# EAGLE design TeensyAmp_R4.0 (EAGLE 9.6.2)

## Sheet 1 of 3
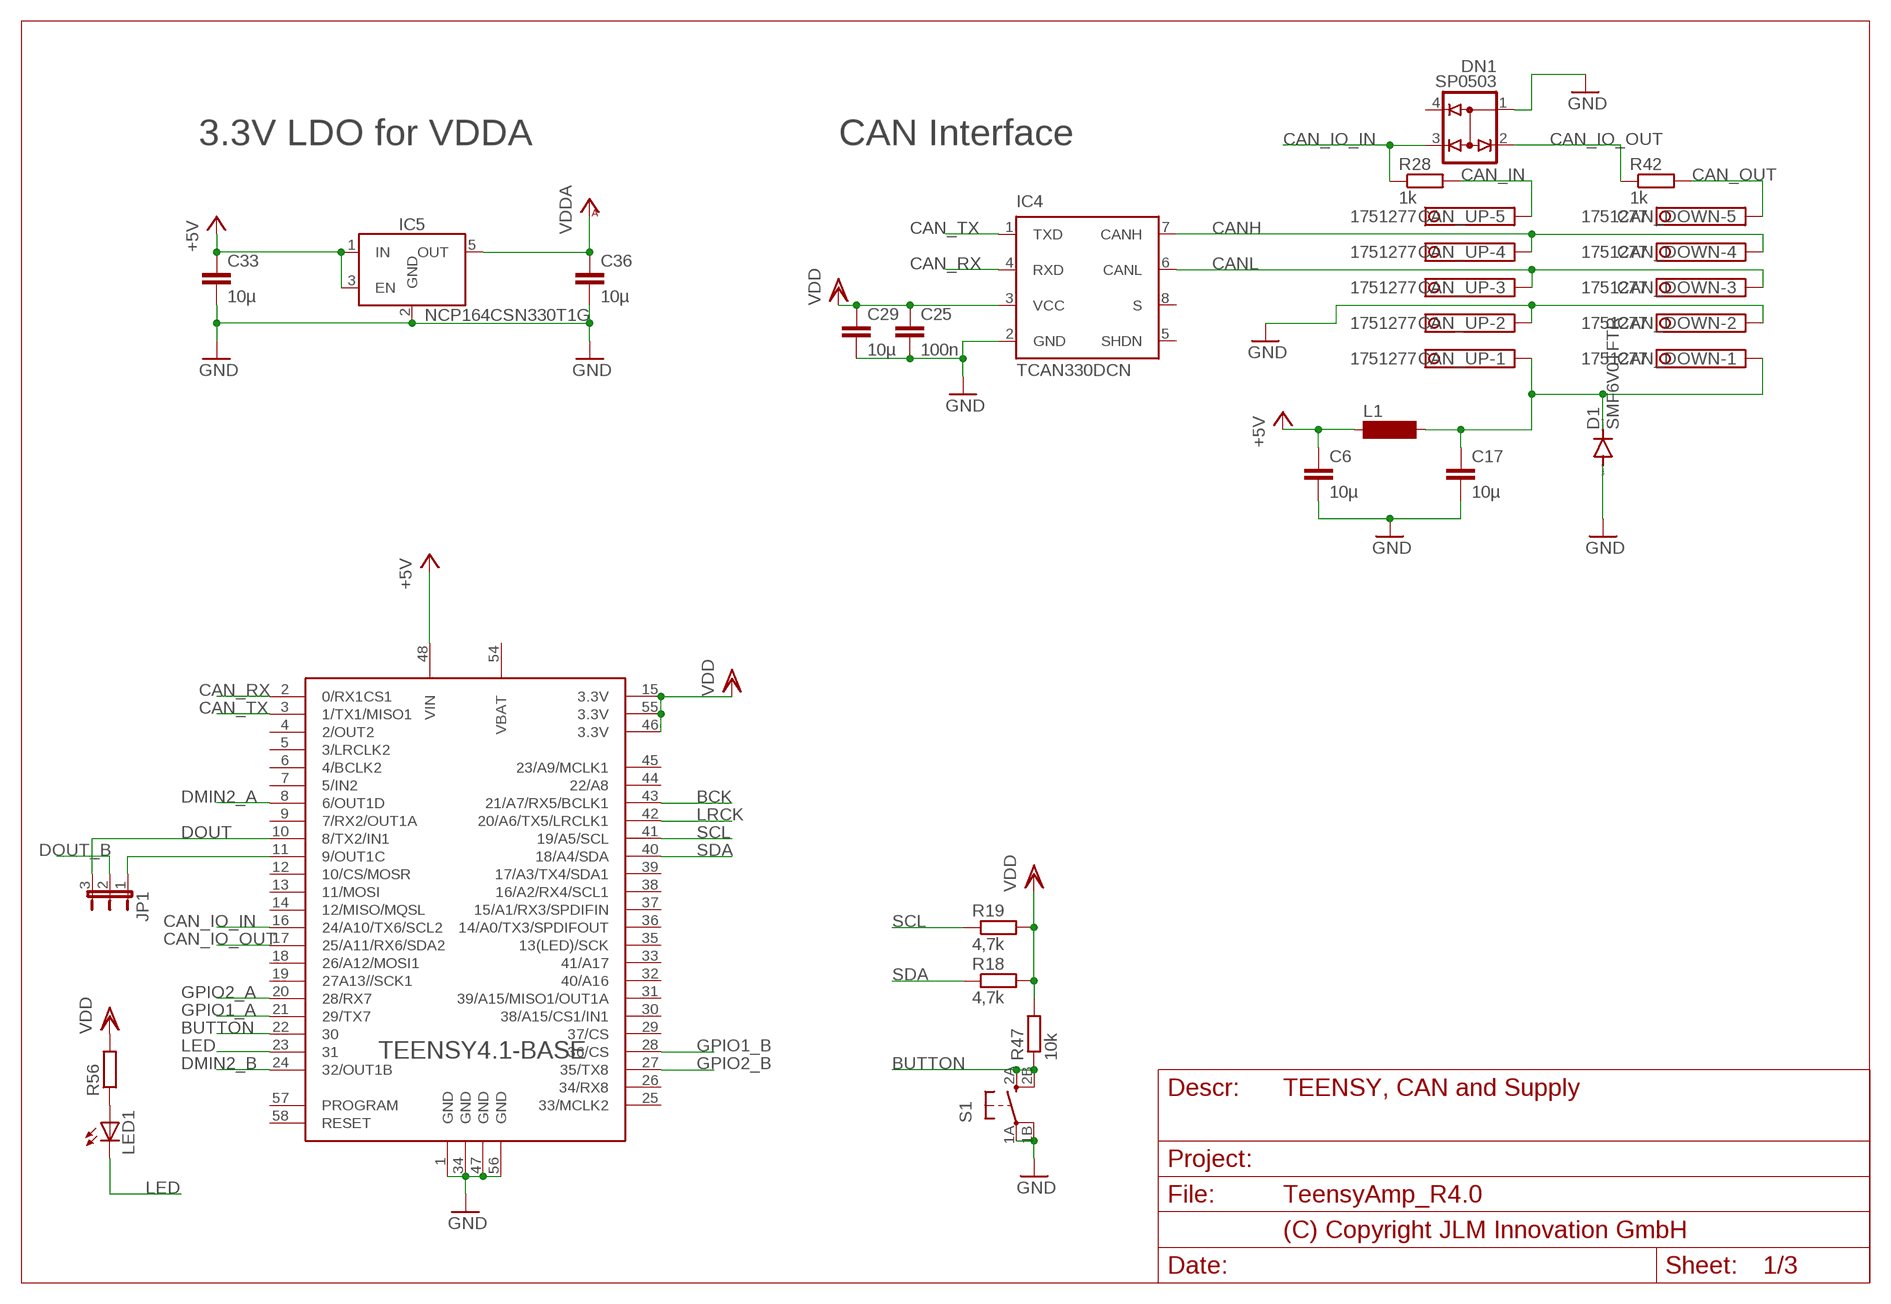
[diagram p0: schematic, sheet 1]
FRAME2 (DINA4_L): PAGE_DESCRIPTION: TEENSY, CAN and Supply

### Parts
C6  10µ  C-EUC0805  [C0805]
C17  10µ  C-EUC0805  [C0805]
C25  100n  C-EU0402-NARROW  [0402-N]
C29  10µ  C-EUC0603  [C0603]
C33  10µ  C-EUC0603  [C0603]
C36  10µ  C-EUC0603  [C0603]
CAN_DOWN  1751277  [1751277]
CAN_UP  1751277  [1751277]
D1  SMF6V0TFTR  DIODE-SOD123  [SOD123]
DN1  SP0503  [SOT143-R]
IC4  TCAN330DCN  [SOT65P280X145-8N]
IC5  NCP164CSN330T1G  LDO_ENSOT23-5  [SOT23-5]
JP1  JP2E  [JP2]
L1  L_JLM0805  [R0805]
LED1  LEDCHIP-LED0603  [CHIP-LED0603]
R18  4,7k  R_JLMR0402  [R0402]
R19  4,7k  R_JLMR0402  [R0402]
R28  1k  R_JLM0402-NARROW  [0402-N]
R42  1k  R_JLM0402-NARROW  [0402-N]
R47  10k  R_JLMR0402  [R0402]
R56  R_JLMR0402  [R0402]
S1  SWITCH7914  [7914J]
TEENSY4.1  TEENSY4.1  [TEENSY4.1]

### Nets
+5V: C6.1 C33.1 IC5.1(IN) IC5.3(EN) L1.1 TEENSY4.1.48(-BASE:VIN)
BCK: TEENSY4.1.43(-BASE:21/A7/RX5/BCLK1) ; also sheet 2,3
BUTTON: R47.1 S1.2A(S) S1.2B(S1) TEENSY4.1.22
CAN_IN: CAN_UP.5 R28.2
CAN_IO_IN: DN1.3(C3) R28.1 TEENSY4.1.16(-BASE:24/A10/TX6/SCL2)
CAN_IO_OUT: DN1.2(C2) R42.1 TEENSY4.1.17(-BASE:25/A11/RX6/SDA2)
CAN_OUT: CAN_DOWN.5 R42.2
CAN_RX: IC4.4(RXD) TEENSY4.1.2(-BASE:0/RX1CS1)
CAN_TX: IC4.1(TXD) TEENSY4.1.3(-BASE:1/TX1/MISO1)
CANH: CAN_DOWN.4 CAN_UP.4 IC4.7(CANH)
CANL: CAN_DOWN.3 CAN_UP.3 IC4.6(CANL)
DMIN2_A: TEENSY4.1.8(-BASE:6/OUT1D) ; also sheet 2
DMIN2_B: TEENSY4.1.24(-BASE:32/OUT1B) ; also sheet 3
DOUT: JP1.3 TEENSY4.1.10(-BASE:8/TX2/IN1) ; also sheet 2
DOUT_B: JP1.2 ; also sheet 3
GND: C6.2 C17.2 C25.2 C29.2 C33.2 C36.2 CAN_DOWN.2 CAN_UP.2 D1.A DN1.1(A1) IC4.2(GND) IC5.2(GND) S1.1A(P) S1.1B(P1) TEENSY4.1.1(-BASE:GND) TEENSY4.1.34(-BASE:GND) TEENSY4.1.47(-BASE:GND) TEENSY4.1.56(-BASE:GND) ; also sheet 2,3
GPIO1_A: TEENSY4.1.21(-BASE:29/TX7) ; also sheet 2
GPIO1_B: TEENSY4.1.28(-BASE:36/CS) ; also sheet 3
GPIO2_A: TEENSY4.1.20(-BASE:28/RX7) ; also sheet 2
GPIO2_B: TEENSY4.1.27(-BASE:35/TX8) ; also sheet 3
LED: LED1.C TEENSY4.1.23
LRCK: TEENSY4.1.42(-BASE:20/A6/TX5/LRCLK1) ; also sheet 2,3
N$12: C17.1 CAN_DOWN.1 CAN_UP.1 D1.C L1.2
N$71: LED1.A R56.1
N$80: JP1.1 TEENSY4.1.11(-BASE:9/OUT1C)
SCL: R19.1 TEENSY4.1.41(-BASE:19/A5/SCL) ; also sheet 2,3
SDA: R18.1 TEENSY4.1.40(-BASE:18/A4/SDA) ; also sheet 2,3
VDD: C25.1 C29.1 IC4.3(VCC) R18.2 R19.2 R47.2 R56.2 TEENSY4.1.15(-BASE:3.3V) TEENSY4.1.46(-BASE:3.3V) TEENSY4.1.55(-BASE:3.3V) ; also sheet 2,3
VDDA: C36.1 IC5.5(OUT) ; also sheet 2,3
Unconnected: DN1.4(C4) IC4.5(SHDN) IC4.8(S) TEENSY4.1.4(-BASE:2/OUT2) TEENSY4.1.5(-BASE:3/LRCLK2) TEENSY4.1.6(-BASE:4/BCLK2) TEENSY4.1.7(-BASE:5/IN2) TEENSY4.1.9(-BASE:7/RX2/OUT1A) TEENSY4.1.12(-BASE:10/CS/MOSR) TEENSY4.1.13(-BASE:11/MOSI) TEENSY4.1.14(-BASE:12/MISO/MQSL) TEENSY4.1.18(-BASE:26/A12/MOSI1) TEENSY4.1.19(-BASE:27A13//SCK1) TEENSY4.1.25(-BASE:33/MCLK2) TEENSY4.1.26(-BASE:34/RX8) TEENSY4.1.29(-BASE:37/CS) TEENSY4.1.30(-BASE:38/A15/CS1/IN1) TEENSY4.1.31(-BASE:39/A15/MISO1/OUT1A) TEENSY4.1.32(-BASE:40/A16) TEENSY4.1.33(-BASE:41/A17) TEENSY4.1.35(-BASE:13(LED)/SCK) TEENSY4.1.36(-BASE:14/A0/TX3/SPDIFOUT) TEENSY4.1.37(-BASE:15/A1/RX3/SPDIFIN) TEENSY4.1.38(-BASE:16/A2/RX4/SCL1) TEENSY4.1.39(-BASE:17/A3/TX4/SDA1) TEENSY4.1.44(-BASE:22/A8) TEENSY4.1.45(-BASE:23/A9/MCLK1) TEENSY4.1.49(-USB:U5V) TEENSY4.1.50(-USB:UDM) TEENSY4.1.51(-USB:UDP) TEENSY4.1.52(-USB:UGND1) TEENSY4.1.53(-USB:UGND2) TEENSY4.1.57(-BASE:PROGRAM) TEENSY4.1.58(-BASE:RESET) TEENSY4.1.59(-ETHERNET:ER-) TEENSY4.1.60(-ETHERNET:ER+) TEENSY4.1.61(-ETHERNET:EGND) TEENSY4.1.62(-ETHERNET:ELED) TEENSY4.1.63(-ETHERNET:ET-) TEENSY4.1.64(-ETHERNET:ET+)

### Notes on the sheet
- 3.3V LDO for VDDA | CAN Interface

## Sheet 2 of 3
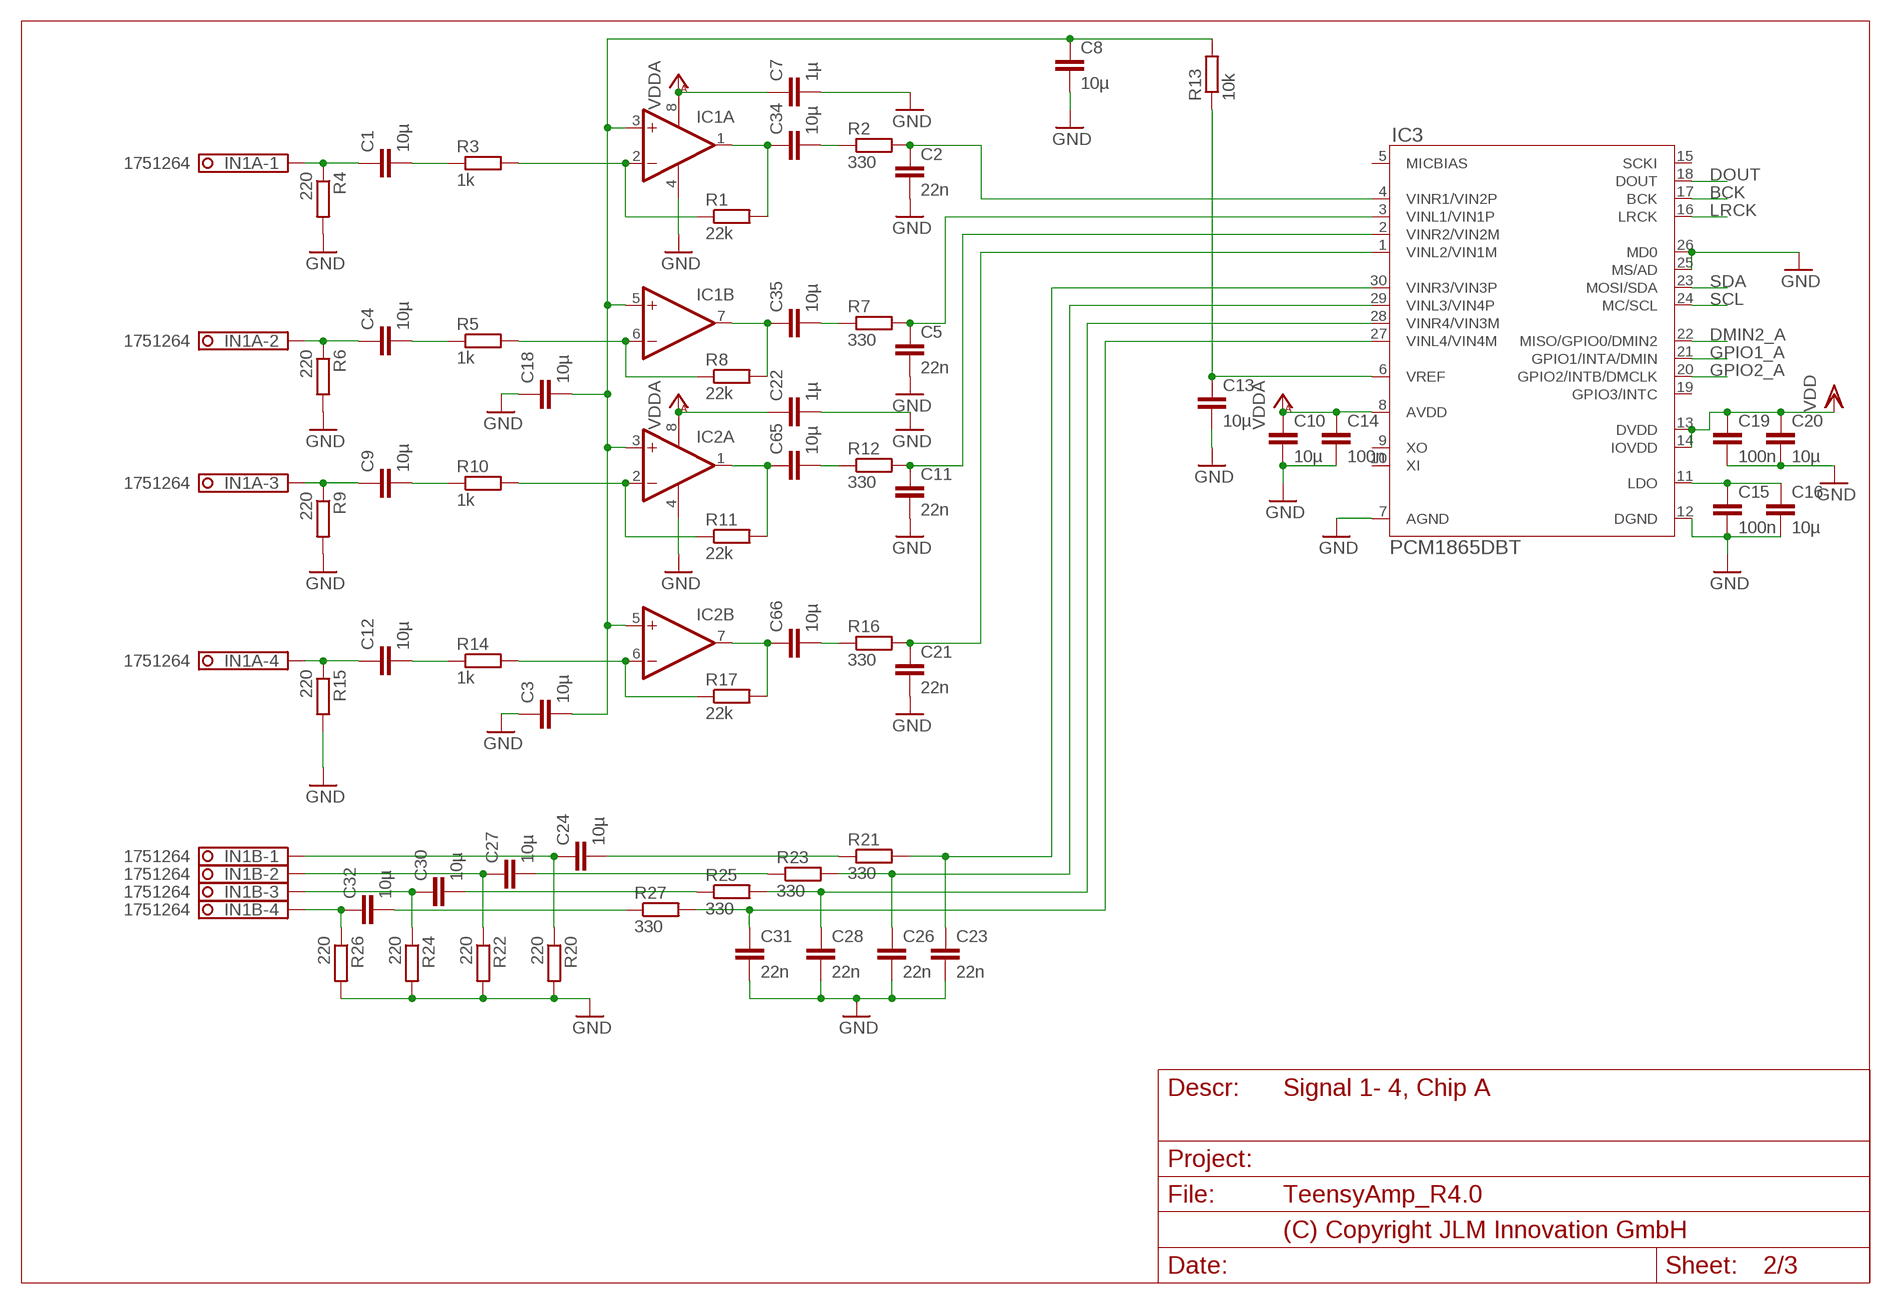
[diagram p1: schematic, sheet 2]
FRAME1 (DINA4_L): PAGE_DESCRIPTION: Signal 1- 4, Chip A

### Parts
C1  10µ  C-EUC0805  [C0805]
C2  22n  C-EUC0603  [C0603]
C3  10µ  C-EUC0603  [C0603]
C4  10µ  C-EUC0805  [C0805]
C5  22n  C-EUC0603  [C0603]
C7  1µ  C-EUC0603  [C0603]
C8  10µ  C-EUC0603  [C0603]
C9  10µ  C-EUC0805  [C0805]
C10  10µ  C-EUC0603  [C0603]
C11  22n  C-EUC0603  [C0603]
C12  10µ  C-EUC0805  [C0805]
C13  10µ  C-EUC0603  [C0603]
C14  100n  C-EU0402-NARROW  [0402-N]
C15  100n  C-EU0402-NARROW  [0402-N]
C16  10µ  C-EUC0603  [C0603]
C18  10µ  C-EUC0603  [C0603]
C19  100n  C-EU0402-NARROW  [0402-N]
C20  10µ  C-EUC0603  [C0603]
C21  22n  C-EUC0603  [C0603]
C22  1µ  C-EUC0603  [C0603]
C23  22n  C-EUC0603  [C0603]
C24  10µ  C-EUC0805  [C0805]
C26  22n  C-EUC0603  [C0603]
C27  10µ  C-EUC0805  [C0805]
C28  22n  C-EUC0603  [C0603]
C30  10µ  C-EUC0805  [C0805]
C31  22n  C-EUC0603  [C0603]
C32  10µ  C-EUC0805  [C0805]
C34  10µ  C-EUC0805  [C0805]
C35  10µ  C-EUC0805  [C0805]
C65  10µ  C-EUC0805  [C0805]
C66  10µ  C-EUC0805  [C0805]
IC1  OPA2344E  [MSOP08]
IC2  OPA2344E  [MSOP08]
IC3  PCM1865DBT  [SOP50P640X120-30N]
IN1A  1751264  [1751264]
IN1B  1751264  [1751264]
R1  22k  R_JLMR0603  [R0603]
R2  330  R_JLMR0603  [R0603]
R3  1k  R_JLMR0603  [R0603]
R4  220  R_JLMR0603  [R0603]
R5  1k  R_JLMR0603  [R0603]
R6  220  R_JLMR0603  [R0603]
R7  330  R_JLMR0603  [R0603]
R8  22k  R_JLMR0603  [R0603]
R9  220  R_JLMR0603  [R0603]
R10  1k  R_JLMR0603  [R0603]
R11  22k  R_JLMR0603  [R0603]
R12  330  R_JLMR0603  [R0603]
R13  10k  R_JLM0402-NARROW  [0402-N]
R14  1k  R_JLMR0603  [R0603]
R15  220  R_JLMR0603  [R0603]
R16  330  R_JLMR0603  [R0603]
R17  22k  R_JLMR0603  [R0603]
R20  220  R_JLMR0603  [R0603]
R21  330  R_JLMR0603  [R0603]
R22  220  R_JLMR0603  [R0603]
R23  330  R_JLMR0603  [R0603]
R24  220  R_JLMR0603  [R0603]
R25  330  R_JLMR0603  [R0603]
R26  220  R_JLMR0603  [R0603]
R27  330  R_JLMR0603  [R0603]

### Nets
BCK: IC3.17(BCK) ; also sheet 1,3
DMIN2_A: IC3.22(MISO/GPIO0/DMIN2) ; also sheet 1
DOUT: IC3.18(DOUT) ; also sheet 1
GND: C2.2 C3.1 C5.2 C7.2 C8.2 C10.2 C11.2 C13.2 C14.2 C15.2 C16.2 C18.1 C19.2 C20.2 C21.2 C22.2 C23.2 C26.2 C28.2 C31.2 IC1.4(A:V-) IC2.4(A:V-) IC3.7(AGND) IC3.12(DGND) IC3.25(MS/AD) IC3.26(MD0) R4.2 R6.2 R9.2 R15.2 R20.2 R22.2 R24.2 R26.2 ; also sheet 1,3
GPIO1_A: IC3.21(GPIO1/INTA/DMIN) ; also sheet 1
GPIO2_A: IC3.20(GPIO2/INTB/DMCLK) ; also sheet 1
LRCK: IC3.16(LRCK) ; also sheet 1,3
N$1: C31.1 IC3.27(VINL4/VIN4M) R27.2
N$2: C28.1 IC3.28(VINR4/VIN3M) R25.2
N$3: C26.1 IC3.29(VINL3/VIN4P) R23.2
N$4: C23.1 IC3.30(VINR3/VIN3P) R21.2
N$5: C21.1 IC3.1(VINL2/VIN1M) R16.2
N$6: C11.1 IC3.2(VINR2/VIN2M) R12.2
N$7: C5.1 IC3.3(VINL1/VIN1P) R7.2
N$8: C2.1 IC3.4(VINR1/VIN2P) R2.2
N$9: C32.2 R27.1
N$10: C24.1 IN1B.1 R20.1
N$11: C15.1 C16.1 IC3.11(LDO)
N$13: C27.1 IN1B.2 R22.1
N$14: C30.1 IN1B.3 R24.1
N$15: C32.1 IN1B.4 R26.1
N$16: C12.1 IN1A.4 R15.1
N$18: C9.1 IN1A.3 R9.1
N$19: C4.1 IN1A.2 R6.1
N$20: C30.2 R25.1
N$21: C1.1 IN1A.1 R4.1
N$22: C27.2 R23.1
N$23: C4.2 R5.1
N$24: C9.2 R10.1
N$25: C1.2 R3.1
N$26: C12.2 R14.1
N$28: C34.1 IC1.1(A:OUT) R1.2
N$29: C35.1 IC1.7(B:OUT) R8.2
N$30: C65.1 IC2.1(A:OUT) R11.2
N$31: IC1.2(A:-IN) R1.1 R3.2
N$32: IC1.6(B:-IN) R5.2 R8.1
N$33: IC2.2(A:-IN) R10.2 R11.1
N$34: IC2.6(B:-IN) R14.2 R17.1
N$35: C66.1 IC2.7(B:OUT) R17.2
N$36: C24.2 R21.1
N$37: C13.1 IC3.6(VREF) R13.1
N$73: C34.2 R2.1
N$74: C3.2 C8.1 C18.2 IC1.3(A:+IN) IC1.5(B:+IN) IC2.3(A:+IN) IC2.5(B:+IN) R13.2
N$75: C35.2 R7.1
N$76: C65.2 R12.1
N$77: C66.2 R16.1
SCL: IC3.24(MC/SCL) ; also sheet 1,3
SDA: IC3.23(MOSI/SDA) ; also sheet 1,3
VDD: C19.1 C20.1 IC3.13(DVDD) IC3.14(IOVDD) ; also sheet 1,3
VDDA: C7.1 C10.1 C14.1 C22.1 IC1.8(A:V+) IC2.8(A:V+) IC3.8(AVDD) ; also sheet 1,3
Unconnected: IC3.5(MICBIAS) IC3.9(XO) IC3.10(XI) IC3.15(SCKI) IC3.19(GPIO3/INTC)

## Sheet 3 of 3
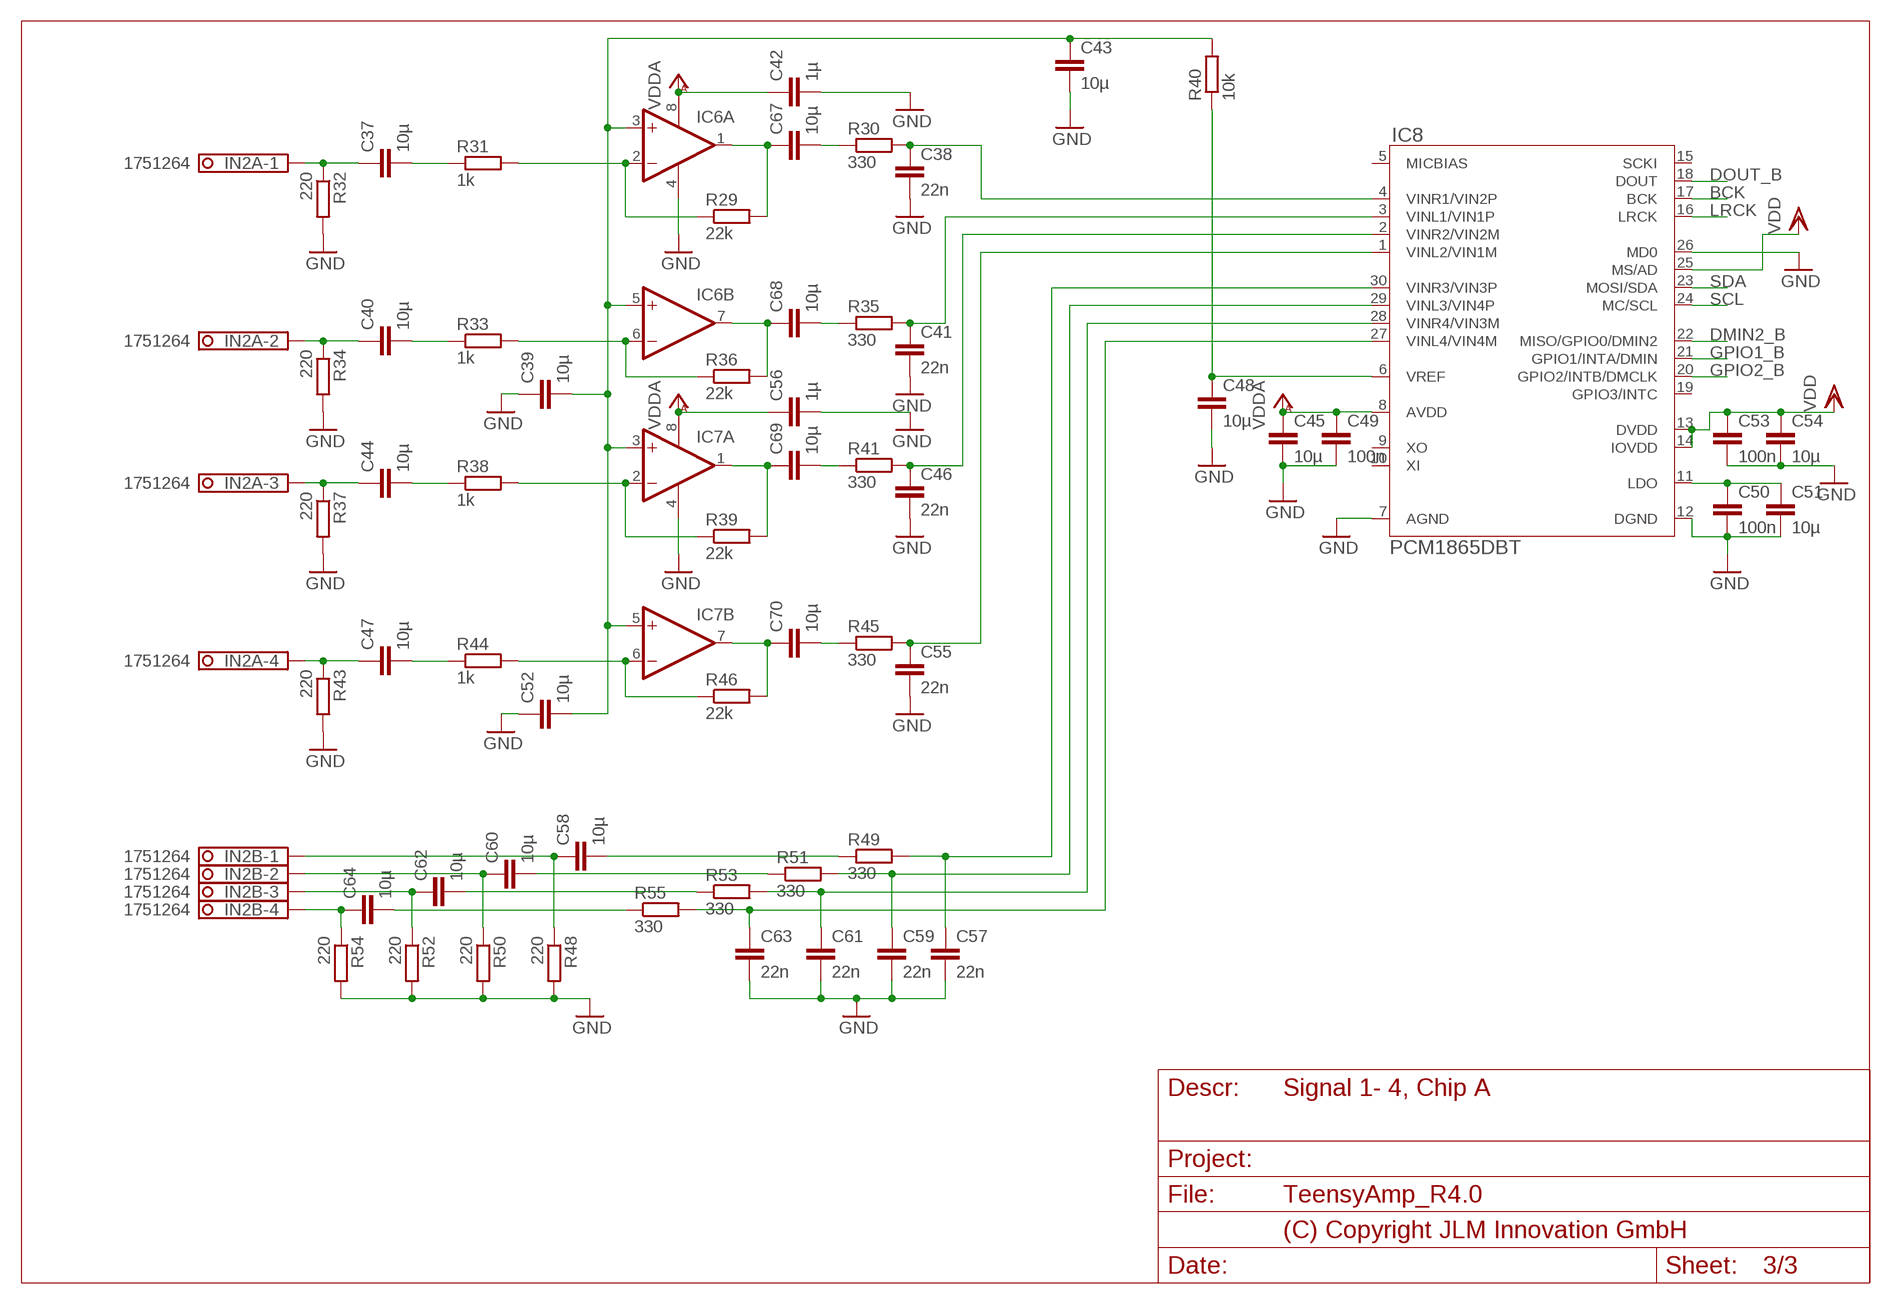
[diagram p2: schematic, sheet 3]
FRAME3 (DINA4_L): PAGE_DESCRIPTION: Signal 1- 4, Chip A

### Parts
C37  10µ  C-EUC0805  [C0805]
C38  22n  C-EUC0603  [C0603]
C39  10µ  C-EUC0603  [C0603]
C40  10µ  C-EUC0805  [C0805]
C41  22n  C-EUC0603  [C0603]
C42  1µ  C-EUC0603  [C0603]
C43  10µ  C-EUC0603  [C0603]
C44  10µ  C-EUC0805  [C0805]
C45  10µ  C-EUC0603  [C0603]
C46  22n  C-EUC0603  [C0603]
C47  10µ  C-EUC0805  [C0805]
C48  10µ  C-EUC0603  [C0603]
C49  100n  C-EU0402-NARROW  [0402-N]
C50  100n  C-EU0402-NARROW  [0402-N]
C51  10µ  C-EUC0603  [C0603]
C52  10µ  C-EUC0603  [C0603]
C53  100n  C-EU0402-NARROW  [0402-N]
C54  10µ  C-EUC0603  [C0603]
C55  22n  C-EUC0603  [C0603]
C56  1µ  C-EUC0603  [C0603]
C57  22n  C-EUC0603  [C0603]
C58  10µ  C-EUC0805  [C0805]
C59  22n  C-EUC0603  [C0603]
C60  10µ  C-EUC0805  [C0805]
C61  22n  C-EUC0603  [C0603]
C62  10µ  C-EUC0805  [C0805]
C63  22n  C-EUC0603  [C0603]
C64  10µ  C-EUC0805  [C0805]
C67  10µ  C-EUC0805  [C0805]
C68  10µ  C-EUC0805  [C0805]
C69  10µ  C-EUC0805  [C0805]
C70  10µ  C-EUC0805  [C0805]
IC6  OPA2344E  [MSOP08]
IC7  OPA2344E  [MSOP08]
IC8  PCM1865DBT  [SOP50P640X120-30N]
IN2A  1751264  [1751264]
IN2B  1751264  [1751264]
R29  22k  R_JLMR0603  [R0603]
R30  330  R_JLMR0603  [R0603]
R31  1k  R_JLMR0603  [R0603]
R32  220  R_JLMR0603  [R0603]
R33  1k  R_JLMR0603  [R0603]
R34  220  R_JLMR0603  [R0603]
R35  330  R_JLMR0603  [R0603]
R36  22k  R_JLMR0603  [R0603]
R37  220  R_JLMR0603  [R0603]
R38  1k  R_JLMR0603  [R0603]
R39  22k  R_JLMR0603  [R0603]
R40  10k  R_JLM0402-NARROW  [0402-N]
R41  330  R_JLMR0603  [R0603]
R43  220  R_JLMR0603  [R0603]
R44  1k  R_JLMR0603  [R0603]
R45  330  R_JLMR0603  [R0603]
R46  22k  R_JLMR0603  [R0603]
R48  220  R_JLMR0603  [R0603]
R49  330  R_JLMR0603  [R0603]
R50  220  R_JLMR0603  [R0603]
R51  330  R_JLMR0603  [R0603]
R52  220  R_JLMR0603  [R0603]
R53  330  R_JLMR0603  [R0603]
R54  220  R_JLMR0603  [R0603]
R55  330  R_JLMR0603  [R0603]

### Nets
BCK: IC8.17(BCK) ; also sheet 1,2
DMIN2_B: IC8.22(MISO/GPIO0/DMIN2) ; also sheet 1
DOUT_B: IC8.18(DOUT) ; also sheet 1
GND: C38.2 C39.1 C41.2 C42.2 C43.2 C45.2 C46.2 C48.2 C49.2 C50.2 C51.2 C52.1 C53.2 C54.2 C55.2 C56.2 C57.2 C59.2 C61.2 C63.2 IC6.4(A:V-) IC7.4(A:V-) IC8.7(AGND) IC8.12(DGND) IC8.26(MD0) R32.2 R34.2 R37.2 R43.2 R48.2 R50.2 R52.2 R54.2 ; also sheet 1,2
GPIO1_B: IC8.21(GPIO1/INTA/DMIN) ; also sheet 1
GPIO2_B: IC8.20(GPIO2/INTB/DMCLK) ; also sheet 1
LRCK: IC8.16(LRCK) ; also sheet 1,2
N$17: C63.1 IC8.27(VINL4/VIN4M) R55.2
N$27: C61.1 IC8.28(VINR4/VIN3M) R53.2
N$38: C59.1 IC8.29(VINL3/VIN4P) R51.2
N$39: C57.1 IC8.30(VINR3/VIN3P) R49.2
N$40: C55.1 IC8.1(VINL2/VIN1M) R45.2
N$41: C46.1 IC8.2(VINR2/VIN2M) R41.2
N$42: C41.1 IC8.3(VINL1/VIN1P) R35.2
N$43: C50.1 C51.1 IC8.11(LDO)
N$44: C58.1 IN2B.1 R48.1
N$45: C60.1 IN2B.2 R50.1
N$46: C62.1 IN2B.3 R52.1
N$47: C64.1 IN2B.4 R54.1
N$48: IC6.2(A:-IN) R29.1 R31.2
N$49: IC6.6(B:-IN) R33.2 R36.1
N$50: IC7.2(A:-IN) R38.2 R39.1
N$51: IC7.6(B:-IN) R44.2 R46.1
N$52: C40.2 R33.1
N$53: C44.2 R38.1
N$54: C47.2 R44.1
N$55: C37.2 R31.1
N$56: C47.1 IN2A.4 R43.1
N$57: C44.1 IN2A.3 R37.1
N$58: C40.1 IN2A.2 R34.1
N$59: C37.1 IN2A.1 R32.1
N$60: C38.1 IC8.4(VINR1/VIN2P) R30.2
N$61: C62.2 R53.1
N$62: C60.2 R51.1
N$63: C58.2 R49.1
N$64: C64.2 R55.1
N$65: C48.1 IC8.6(VREF) R40.1
N$66: C69.1 IC7.1(A:OUT) R39.2
N$67: C68.1 IC6.7(B:OUT) R36.2
N$68: C67.1 IC6.1(A:OUT) R29.2
N$69: C70.1 IC7.7(B:OUT) R46.2
N$70: C39.2 C43.1 C52.2 IC6.3(A:+IN) IC6.5(B:+IN) IC7.3(A:+IN) IC7.5(B:+IN) R40.2
N$78: C70.2 R45.1
N$79: C69.2 R41.1
N$81: C68.2 R35.1
N$82: C67.2 R30.1
SCL: IC8.24(MC/SCL) ; also sheet 1,2
SDA: IC8.23(MOSI/SDA) ; also sheet 1,2
VDD: C53.1 C54.1 IC8.13(DVDD) IC8.14(IOVDD) IC8.25(MS/AD) ; also sheet 1,2
VDDA: C42.1 C45.1 C49.1 C56.1 IC6.8(A:V+) IC7.8(A:V+) IC8.8(AVDD) ; also sheet 1,2
Unconnected: IC8.5(MICBIAS) IC8.9(XO) IC8.10(XI) IC8.15(SCKI) IC8.19(GPIO3/INTC)

## Power pins joined to a net without a drawn wire
VBAT: TEENSY4.1.54(-BASE:VBAT)

## Library data of the parts
C1-C70 = jlm_cap:C-EU: CAPACITOR, European symbol
CAN_DOWN CAN_UP = jlm_con:1751277: MKDS 1/ 5-3,5 Printklemme Nennstrom: 10 A Bemessungsspannung: 160 V Raster: 3,5 mm Polzahl: 5 Montageart: Löten Anschlussart: Schraubanschluss Anschlussrichtung vom Leiter zur Platine: 0° Source: http://eshop.phoenixcontact.com .. 1751277.pdf; OC_FARNELL: unknown; OC_NEWARK: unknown
D1 = jlm_diode:DIODE-: DIODE; OC_FARNELL: 2989529
DN1 = jlm:SP0503: SP0503BA 3 5VDC ESD supression diodes (e.g. USB protection); OC_DIGIKEY: F2715CT-ND; OC_FARNELL: 1827633
IC1 IC2 IC6 IC7 = jlm_linear:OPA2*: Dual Operational Amplifier Low Power, Single-Supply, Rail-To-Rail Operational Amplifier Source: http://focus.ti.com/lit/ds/symlink/opa2345.pdf http://focus.ti.com .. opa241.pdf http://focus.ti.com/lit/ds/symlink/opa2134.pdf
IC3 IC8 = jlm_adc_dac:PCM1865: PCM1865 4-Channel, 192-kHz, Audio ADCs; OC_MOUSER: 595-PCM1865DBT
IC4 = jlm_digital:TCAN330
IC5 = jlm_power:LDO_EN; OC_FARNELL: 3367831
IN1A IN1B IN2A IN2B = jlm_con:1751264: MKDS 1/ 4-3,5 Printklemme Nennstrom: 10 A Bemessungsspannung: 160 V Raster: 3,5 mm Polzahl: 4 Montageart: Löten Anschlussart: Schraubanschluss Anschlussrichtung vom Leiter zur Platine: 0° Source: http://eshop.phoenixcontact.com .. 1751264.pdf; MPN: 1751264; OC_FARNELL: unknown; OC_NEWARK: 10R0934
JP1 = jumper:JP2E: JUMPER
L1 = jlm_inductor:L_JLM
LED1 = jlm_optical:LED: LED OSRAM: - CHIPLED LG R971, LG N971, LY N971, LG Q971, LY Q971, LO R971, LY R971 LH N974, LH R974 LS Q976, LO Q976, LY Q976 LO Q996 - Hyper CHIPLED LW Q18S LB Q993, LB Q99A, LB R99A - SideLED LS A670, LO A670, LY A670, LG A670, LP A670 LB A673, LV A673, LT A673, LW A673 LH A674 LY A675 LS A676, LA A676, LO A676, LY A676, LW A676 LS A679, LY A679, LG A679 - Hyper Micro SIDELED® LS Y876, LA Y876, LO Y876, LY Y876 LT Y87S - SmartLED LW L88C, LW L88S LB L89C, LB L89S, LG L890 LS L89K, LO L89K, LY L89K LS L896, LA L896, LO L896, LY L896 - TOPLED LS T670, LO T670, LY T670, LG T670, LP T670 LSG T670, LSP T670, LSY T670, LOP T670, LYG T670 LG T671, LOG T671, LSG T671 LB T673, LV T673, LT T673, LW T673 LH T674 LS T676, LA T676, LO T676, LY T676, LB T676, LH T676, LSB T676, LW T676 LB T67C, LV T67C, LT T67C, LS T67K, LO T67K, LY T67K, LW E67C LS E67B, LA E67B, LO E67B, LY E67B, LB E67C, LV E67C, LT E67C LW T67C LS T679, LY T679, LG T679 LS T770, LO T770, LY T770, LG T770, LP T770 LB T773, LV T773, LT T773, LW T773 LH T774 LS E675, LA E675, LY E675, LS T675 LS T776, LA T776, LO T776, LY T776, LB T776 LHGB T686 LT T68C, LB T68C - Hyper Mini TOPLED® LB M676 - Mini TOPLED Santana® LG M470 LS M47K, LO M47K, LY M47K Source: http://www.osram.convergy.de LUXEON: - LUMILED® LXK2-PW12-R00, LXK2-PW12-S00, LXK2-PW14-U00, LXK2-PW14-V00 LXK2-PM12-R00, LXK2-PM12-S00, LXK2-PM14-U00 LXK2-PE12-Q00, LXK2-PE12-R00, LXK2-PE12-S00, LXK2-PE14-T00, LXK2-PE14-U00 LXK2-PB12-K00, LXK2-PB12-L00, LXK2-PB12-M00, LXK2-PB14-N00, LXK2-PB14-P00, LXK2-PB14-Q00 LXK2-PR12-L00, LXK2-PR12-M00, LXK2-PR14-Q00, LXK2-PR14-R00 LXK2-PD12-Q00, LXK2-PD12-R00, LXK2-PD12-S00 LXK2-PH12-R00, LXK2-PH12-S00 LXK2-PL12-P00, LXK2-PL12-Q00, LXK2-PL12-R00 Source: www.luxeon.com KINGBRIGHT: KA-3528ASYC Source: www.kingbright.com
R1-R56 = jlm_resistors:R_JLM: RESISTOR, European symbol
S1 = jlm_switch:SWITCH7914: OMRON SWITCH; OC_FARNELL: 1607974
TEENSY4.1 = jlm_micro:TEENSY4.1: Teensy 4.1 Modul ease pin connections (top side ONLY) Separate "gates" for Ethernet and hosted USB

## Board
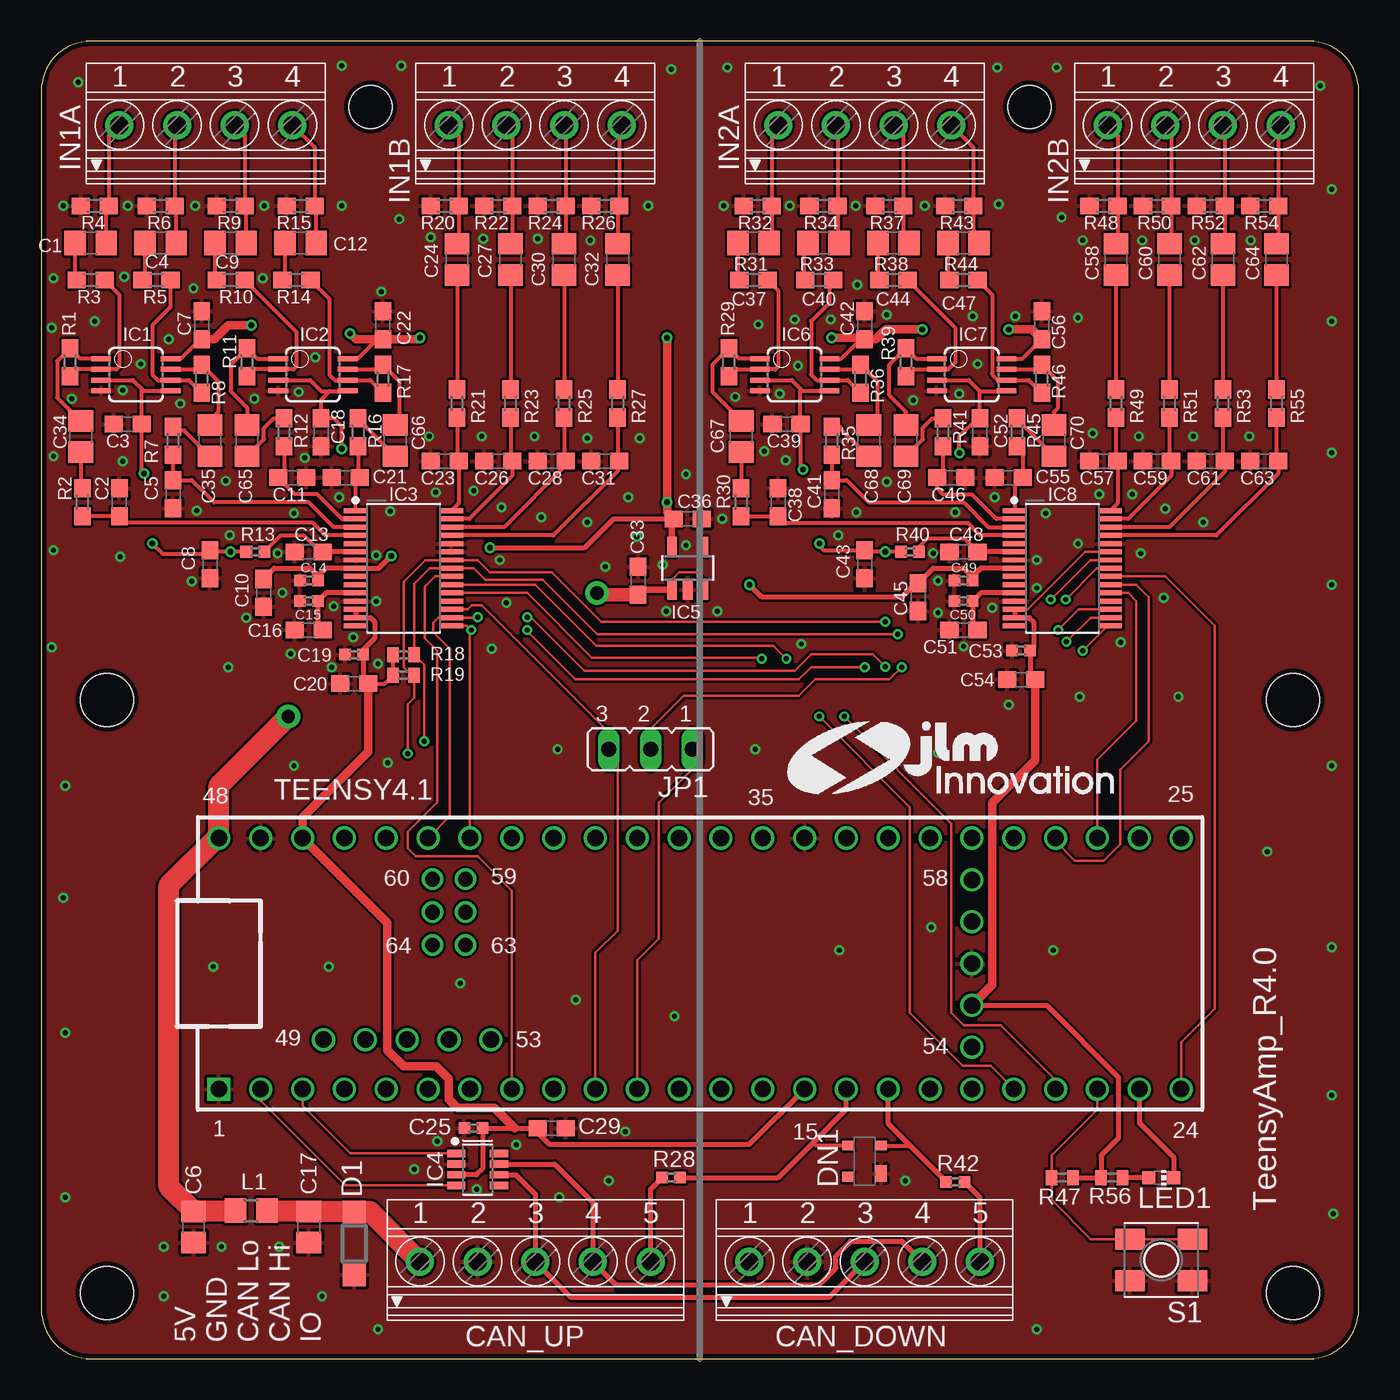
[diagram p3: board, top side]
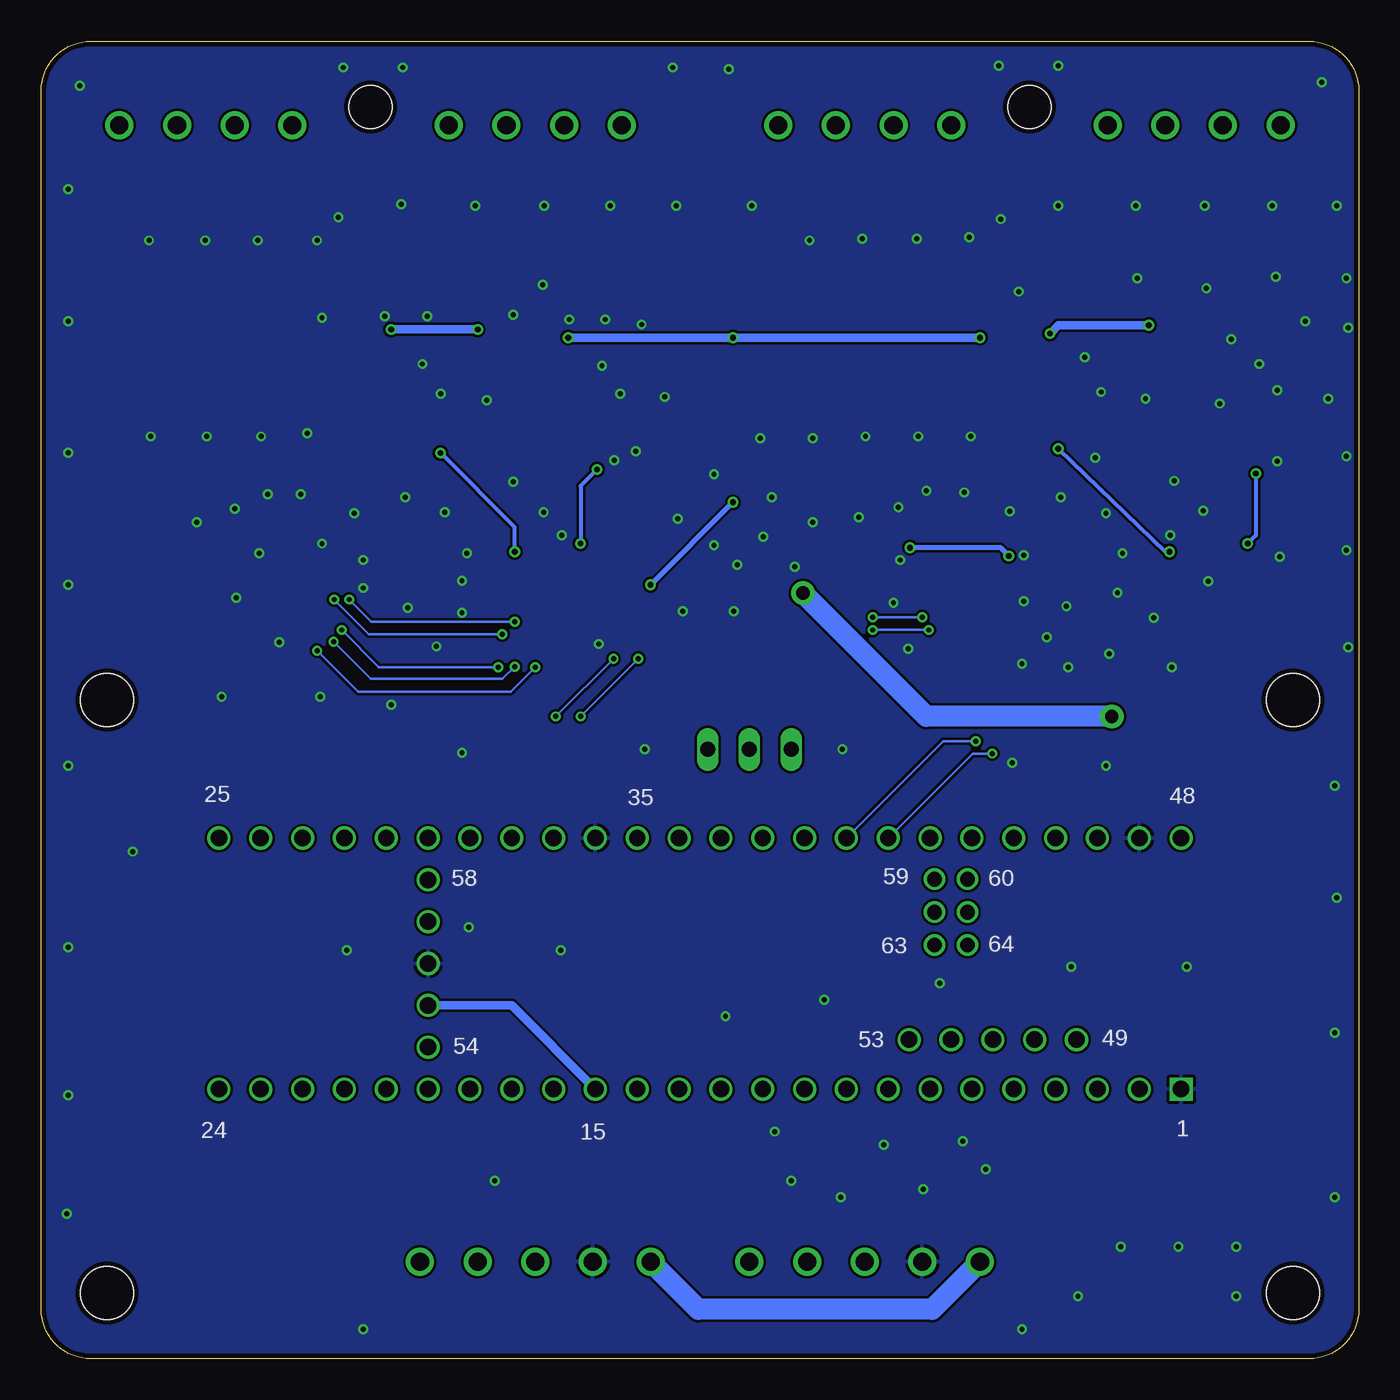
[diagram p4: board, bottom side, seen from below]

Size 80 x 80 mm. Coordinates in mm from the lower left corner, seen from the top.
Outline: 0,3 arc90 3,0 77,0 arc90 80,3 80,77 arc90 77,80 3,80 arc90 0,77 0,3
Copper layers (1*16): Top 0.035mm / dielectric 1.5mm / Bottom 0.035mm
Design rules "PCB-POOL Standard": minimum track width 0.15mm, minimum drill 0.3mm, track to track 0.15mm, track to pad 0.15mm, pad to pad 0.15mm, via to via 0.15mm, smd to smd 0.15mm, copper to edge 0.3mm, drill to drill 0.2mm, minimum pad ring 0.2mm, minimum via ring 0.15mm, stop-mask expansion 0.03mm, vias tented up to drill 0mil, thermal gap 0.2mm
Holes 3.2 mm at 4,4 76,4 4,40 76,40
Holes 2.6 mm at 60,76 20,76

### Footprints (pad centres in the part's own frame; a part is rotated, then mirrored left to right if it is on the bottom)
C0805 = smd 1.3 x 1.5: 1 -0.95,0; 2 0.95,0
C0603 = smd 1.1 x 1: 1 -0.85,0; 2 0.85,0
0402-N = smd 0.7 x 0.7: 1 -0.55,0; 2 0.55,0
1751277 = drill 1.1 pad 1.7: 1 -7,-0.1; 2 -3.5,-0.1; 3 0,-0.1; 4 3.5,-0.1; 5 7,-0.1
SOD123 = smd 1.4 x 1.4: A 1.9,0; C -1.9,0
SOT143-R = smd 1 x 0.7: 1 -0.75,-1 | smd 0.6 x 0.7: 2 0.95,-1; 3 0.95,1; 4 -0.95,1
MSOP08 = smd 0.3 x 1.2: 1 -0.976,-2.113; 2 -0.326,-2.113; 3 0.324,-2.113; 4 0.974,-2.113; 5 0.974,2.112; 6 0.324,2.112; 7 -0.326,2.112; 8 -0.976,2.112
SOP50P640X120-30N = smd 1.5 x 0.3: 1 -2.9,3.5; 2 -2.9,3; 3 -2.9,2.5; 4 -2.9,2; 5 -2.9,1.5; 6 -2.9,1; 7 -2.9,0.5; 8 -2.9,0; 9 -2.9,-0.5; 10 -2.9,-1; 11 -2.9,-1.5; 12 -2.9,-2; 13 -2.9,-2.5; 14 -2.9,-3; 15 -2.9,-3.5; 16 2.9,-3.5; 17 2.9,-3; 18 2.9,-2.5; 19 2.9,-2; 20 2.9,-1.5; 21 2.9,-1; 22 2.9,-0.5; 23 2.9,0; 24 2.9,0.5; 25 2.9,1; 26 2.9,1.5; 27 2.9,2; 28 2.9,2.5; 29 2.9,3; 30 2.9,3.5
SOT65P280X145-8N = smd 1.1 x 0.45: 1 -1.3,0.975; 2 -1.3,0.325; 3 -1.3,-0.325; 4 -1.3,-0.975; 5 1.3,-0.975; 6 1.3,-0.325; 7 1.3,0.325; 8 1.3,0.975
SOT23-5 = smd 0.6 x 1.2: 1 -0.95,-1.306; 2 0,-1.306; 3 0.95,-1.306; 4 0.95,1.306; 5 -0.95,1.306
1751264 = drill 1.1 pad 1.7: 1 -5.25,-0.1; 2 -1.75,-0.1; 3 1.75,-0.1; 4 5.25,-0.1
JP2 = drill 0.914 long: 1 -2.54,0; 2 0,0; 3 2.54,0
R0805 = smd 1.3 x 1.5: 1 -0.95,0; 2 0.95,0
CHIP-LED0603 = smd 0.8 x 0.8: A 0,-0.75; C 0,0.75
R0603 = smd 1.1 x 1: 1 -0.85,0; 2 0.85,0
R0402 = smd 0.7 x 0.9: 1 -0.65,0; 2 0.65,0
7914J = smd 1.27 x 1.78: 1A -1.27,1.9; 1B -1.27,-1.9; 2A 1.27,1.9; 2B 1.27,-1.9
TEENSY4.1 = drill 1 square: 1 -29.21,-7.62 | drill 1: 2 -26.67,-7.62; 3 -24.13,-7.62; 4 -21.59,-7.62; 5 -19.05,-7.62; 6 -16.51,-7.62; 7 -13.97,-7.62; 8 -11.43,-7.62; 9 -8.89,-7.62; 10 -6.35,-7.62; 11 -3.81,-7.62; 12 -1.27,-7.62; 13 1.27,-7.62; 14 3.81,-7.62; 15 6.35,-7.62; 16 8.89,-7.62; 17 11.43,-7.62; 18 13.97,-7.62; 19 16.51,-7.62; 20 19.05,-7.62; 21 21.59,-7.62; 22 24.13,-7.62; 23 26.67,-7.62; 24 29.21,-7.62; 25 29.21,7.62; 26 26.67,7.62; 27 24.13,7.62; 28 21.59,7.62; 29 19.05,7.62; 30 16.51,7.62; 31 13.97,7.62; 32 11.43,7.62; 33 8.89,7.62; 34 6.35,7.62; 35 3.81,7.62; 36 1.27,7.62; 37 -1.27,7.62; 38 -3.81,7.62; 39 -6.35,7.62; 40 -8.89,7.62; 41 -11.43,7.62; 42 -13.97,7.62; 43 -16.51,7.62; 44 -19.05,7.62; 45 -21.59,7.62; 46 -24.13,7.62; 47 -26.67,7.62; 48 -29.21,7.62; 49 -22.86,-4.62; 50 -20.32,-4.62; 51 -17.78,-4.62; 52 -15.24,-4.62; 53 -12.7,-4.62; 54 16.51,-5.08; 55 16.51,-2.54; 56 16.51,0; 57 16.51,2.54; 58 16.51,5.08 | drill 0.9: 59 -14.24,5.12; 60 -16.24,5.12; 61 -14.24,3.12; 62 -16.24,3.12; 63 -14.24,1.12; 64 -16.24,1.12

### Placement (x,y rotation side)
C1  3,67.75 180 top
C2  4.75,52 90 top
C3  5.25,56.75 0 top
C4  7.25,67.75 180 top
C5  8,52.5 270 top
C6  9.25,8 270 top
C7  9.75,62.75 90 top
C8  10.25,48.25 270 top
C9  11.5,67.75 180 top
C10  13.5,46.5 270 top
C11  15.25,53.5 0 top
C12  15.75,67.75 180 top
C13  16.25,49 180 top
C14  16.25,47.25 180 top
C15  16.25,46 180 top
C16  16.25,44.25 180 top
C17  16.25,8 270 top
C18  17,56.25 90 top
C19  19,42.75 180 top
C20  19,41 180 top
C21  18.5,53.5 180 top
C22  20.75,62.75 90 top
C23  24.5,54.5 180 top
C24  25.25,66.75 270 top
C25  26.25,14 180 top
C26  27.75,54.5 180 top
C27  28.5,66.75 270 top
C28  31,54.5 180 top
C29  31,14 0 top
C30  31.75,66.75 270 top
C31  34.25,54.5 180 top
C32  35,66.75 270 top
C33  36.25,47.25 90 top
C34  2.4,56 270 top
C35  10.25,55.75 270 top
C36  39.25,51 0 top
C37  43.25,67.75 180 top
C38  44.75,52 90 top
C39  45.25,56.75 0 top
C40  47.5,67.75 180 top
C41  48,52.5 270 top
C42  50,62.75 90 top
C43  50,48.25 270 top
C44  51.75,67.75 180 top
C45  53.25,46.25 270 top
C46  55.25,53.5 0 top
C47  56,67.75 180 top
C48  56,49 180 top
C49  56,47.25 180 top
C50  56,46 180 top
C51  56,44.25 180 top
C52  57,56.25 90 top
C53  59.5,43 180 top
C54  59.5,41.25 180 top
C55  58.75,53.5 180 top
C56  60.75,62.75 90 top
C57  64.5,54.5 180 top
C58  65.25,66.75 270 top
C59  67.75,54.5 180 top
C60  68.5,66.75 270 top
C61  71,54.5 180 top
C62  71.75,66.75 270 top
C63  74.25,54.5 180 top
C64  75,66.75 270 top
C65  12.5,55.75 270 top
C66  21.5,55.75 270 top
C67  42.5,56 270 top
C68  50.25,55.75 270 top
C69  52.5,55.75 270 top
C70  61.5,55.75 270 top
CAN_DOWN  50,6 0 top
CAN_UP  30,6 0 top
D1  19,7 270 top
DN1  50,12 90 top
IC1  5.75,59.75 270 top
IC2  16.5,59.75 270 top
IC3  22,48 0 top
IC4  26.5,11.5 0 top
IC5  39.25,48 0 top
IC6  45.75,59.75 270 top
IC7  56.5,59.75 270 top
IC8  62,48 0 top
IN1A  10,75 0 top
IN1B  30,75 0 top
IN2A  50,75 0 top
IN2B  70,75 0 top
JP1  37,37 180 top
L1  12.75,9 0 top
LED1  68,11 270 top
R1  1.75,60.5 90 top
R2  2.5,52 270 top
R3  3,65.5 0 top
R4  3.25,70 180 top
R5  7,65.5 0 top
R6  7.25,70 180 top
R7  8,55.75 270 top
R8  9.75,59.5 90 top
R9  11.5,70 180 top
R10  11.5,65.5 0 top
R11  12.5,60.5 90 top
R12  14.75,56.25 270 top
R13  13,49 180 top
R14  15.5,65.5 0 top
R15  15.75,70 180 top
R16  19.25,56.25 270 top
R17  20.75,59.5 90 top
R18  22,42.75 180 top
R19  22,41.5 180 top
R20  24.5,70 180 top
R21  25.25,58 270 top
R22  27.75,70 180 top
R23  28.5,58 270 top
R24  31,70 180 top
R25  31.75,58 270 top
R26  34.25,70 180 top
R27  35,58 270 top
R28  38.25,11 180 top
R29  41.75,60.5 90 top
R30  42.5,52 270 top
R31  43.25,65.5 0 top
R32  43.5,70 180 top
R33  47.25,65.5 0 top
R34  47.5,70 180 top
R35  48,55.75 270 top
R36  49.75,59.5 90 top
R37  51.5,70 180 top
R38  51.75,65.5 0 top
R39  52.5,60.5 90 top
R40  52.75,49 180 top
R41  54.75,56.25 270 top
R42  55.5,10.75 0 top
R43  55.75,70 180 top
R44  56,65.5 0 top
R45  59.25,56.25 270 top
R46  60.75,59.5 90 top
R47  62,11 0 top
R48  64.5,70 180 top
R49  65.25,58 270 top
R50  67.75,70 180 top
R51  68.5,58 270 top
R52  71,70 180 top
R53  71.75,58 270 top
R54  74.25,70 180 top
R55  75,58 270 top
R56  65,11 180 top
S1  68,6 90 top
TEENSY4.1  40,24 0 top
U$1  [JLM_LOGO_MID]  45,34 0 top

### Tracks (layer width: path | path; a pad name or v marks a point on that pad's centre or on a via)
+5V  (via drill 0.8)
  Top 0.152: IC5.3 40.2,47.3 39.75,47.75 38.75,47.75 38.3,47.3 IC5.1
  Top 0.406: IC5.1 36.54,46.69 36.42,46.58 C33.1
  Top 0.813: C33.1 33.85,46.4 v33.75,46.5
  Top 1.27: L1.1 9.3,9 C6.1 7.75,10.45 7.75,28.75 10.62,31.62 TEENSY4.1.48 10.79,34.79 v15,39
  Bottom 1.27: v15,39 26.25,39 v33.75,46.5
BCK  (via drill 0.3)
  Top 0.152: 26.47,45 26.25,45 | 26.25,45 IC3.17 24.1,45 23.8,44.7 23.8,44.1 24.8,43.1 24.8,32.93 TEENSY4.1.43 | 26.25,45 26.22,45.03 v26.5,45.03 | v62.25,43.53 63.72,45 IC8.17 | v51.25,42.03 50.5,42.78 46.75,42.78 45.75,41.78 32.97,41.78 29.72,45.03 v29.5,45.03
  Bottom 0.152: v62.25,43.53 60,41.28 52,41.28 v51.25,42.03 | v29.5,45.03 v26.5,45.03
BUTTON
  Top 0.152: S1.2B S1.2A 63.73,7.27 61.35,9.65 R47.1 61.35,12.35 64.13,15.13 TEENSY4.1.22
CAN_IN
  Top 0.305: CAN_UP.5 37,10.3 R28.2
CAN_IO_IN
  Top 0.254: DN1.3 47.05,12.95 46.88,13.12
  Top 0.305: R28.1 44.75,11 46.88,13.12 48.89,15.14 TEENSY4.1.16
CAN_IO_OUT
  Top 0.254: DN1.2 52.75,12.95 52.85,12.85
  Top 0.305: R42.1 52.85,12.85 51.43,14.27 TEENSY4.1.17
CAN_OUT
  Top 0.305: R42.2 57,9.8 CAN_DOWN.5
CAN_RX
  Top 0.152: IC4.4 18.48,10.53 13.33,15.67 TEENSY4.1.2
CAN_TX
  Top 0.152: IC4.1 18.77,12.47 15.87,15.38 TEENSY4.1.3
CANH
  Top 0.305: CAN_DOWN.4 52.25,7.15 49.15,7.15 48.25,6.25 48.25,5.5 47.25,4.5 34.9,4.5 CAN_UP.4 33.5,9.5 31.18,11.82 IC4.7
CANL
  Top 0.305: CAN_DOWN.3 47.85,3.75 32.15,3.75 CAN_UP.3 30,10 28.82,11.18 IC4.6
DMIN2_A
  Top 0.152: TEENSY4.1.8 28.57,28.43 26.5,30.5 22.75,30.5 22.25,31 22.25,32 24.05,33.8 24.05,43 23.29,43.76 23.29,46.86 23.93,47.5 IC3.22
DMIN2_B
  Top 0.152: IC8.22 68.25,47.5 71.25,44.5 71.25,21.25 69.21,19.21 TEENSY4.1.24
DOUT
  Top 0.152: TEENSY4.1.10 33.65,24.65 35,26 35,36.46 JP1.3 34.46,38.04 26.75,45.75 26.15,45.75 25.9,45.5 IC3.18
DOUT_B  (via drill 0.3)
  Top 0.152: IC8.18 63,45.5 v61.75,44.25 | v52.25,42 51.5,41.25 47,41.25 46,40.25 39,40.25 37,38.25 JP1.2
  Bottom 0.152: v61.75,44.25 59.5,42 v52.25,42
GND  (via drill 0.3)
  other vias: 54.45,45.3 54.45,47.25 56,43.25 60.45,48.5 54.15,48.9 57.75,45.6 62.95,49.5 61,51.35 64.25,52.5 66.25,52.5 68.25,51.6 70.55,50.8 66.75,48.9 63.25,67.9 66.85,67.9 70.05,67.9 73.45,67.9 53.65,70 49.45,70 45.45,70 41.45,70 44.85,58.6 42.15,58.4 43.9,55.1 45.2,54.55 51.35,53.25 57.9,52.3 55.75,58.6 52.95,58.2 43.55,62.8 45.75,63.1 47.95,63.1 51.35,63.4 49.55,65.2 56.55,63.3 56.85,60.4 59.15,63.3 62.95,63.2 63.85,56.2 17.45,23.8 25.45,22.8 32.45,21.8 38.45,20.8 48.45,24.8 61.45,24.8 74.45,30.8 78.45,8.8 1.45,9.8 1.45,34.8 1.45,19.8 10.45,23.8 7.45,3.8 20.45,1.8 60.45,1.8 52.45,10.8 34.45,10.8 14.45,6.8 17.05,3.8 10.95,6.8 7.45,6.8 54.45,36.8 58.75,39.7 46.15,43.4 37.95,45.4 41.05,45.4 39.15,49.4 41.35,51 36.15,49.9 34.25,48.1 37.75,48.2 20.35,46 17.75,45.7 14.65,46.5 12.45,45 9.15,47.2 14.35,48.9 20.35,48.8 60.45,46.8 17.65,42 27.85,48.5 33.15,50.8 30.35,51.1 27.95,51.7 26.25,52.7 23.95,52.6 21.2,51.45 18.1,52.3 15.35,51.35 4.8,48.7 4.95,54.5 9.45,51.5 16,54.7 15.65,58.7 4.95,58.8 1.85,58.3 12.95,58.3 6.05,60.4 16.65,60.8 20.65,64.8 9.25,65 9.35,70 13.55,70 5.25,70 1.35,70 0.75,65.6 0.65,62.6 0.75,54.8 0.75,49.1 0.65,43.2 2.25,77.5 38.25,78.3 41.65,78.4 36.85,70 33.35,67.9 30.15,68 26.85,68 23.65,68.1 13.45,65.6 5.05,65.7 3.25,63 7.75,61.9 18.25,70 21.75,69.2 21.85,78.5 18.25,78.5 58.05,78.4 61.65,78.4 61.95,69.3 58.15,70.1 77.65,77.3 78.35,71 78.35,63 78.35,55 78.35,47 78.35,36 78.35,25 78.35,16 1.35,28 31.35,37 43.35,37 11.35,42 15.35,36 54.05,26.2 63.05,40.2 69.05,40.2 21.05,36.2 45.95,60.3 73.35,56 69.95,56 66.65,56 26.75,56 29.95,56 33.15,55.9 36.35,55.9 23.55,56 31.45,9.8 48.4,50 49.5,51.4 55.5,51.4 11.2,53.3 11.45,50 8.45,58 65.55,43.5 68.15,46.2 27.35,43.1 28.25,45.9 35.65,52.3 39.15,53.7 15.15,42.8 18.95,43.8 20.45,42.2 35.45,13.8 24.05,13.2 22.65,11.5 26.45,10.3 28.85,13
  pour Top: 0,0 0,80 80,80 80,0
  pour Bottom: 0,0 0,80 80,80 80,0
GPIO1_A  (via drill 0.3)
  Top 0.152: v48.75,39 55.25,32.5 55.25,21 56,20.25 58.25,20.25 61.59,16.91 TEENSY4.1.21 | IC3.21 30,47 33.7,43.3 44.45,43.3 v45.25,42.5
  Bottom 0.152: v48.75,39 v45.25,42.5
GPIO1_B
  Top 0.152: IC8.21 66.5,47 67.25,46.25 67.25,37.5 65.5,35.75 65.5,31.25 64.5,30.25 62.75,30.25 61.59,31.41 TEENSY4.1.28
GPIO2_A  (via drill 0.3)
  Top 0.152: TEENSY4.1.20 59.05,16.4 57.64,17.81 55.94,17.81 52.75,21 52.75,33.5 v47.25,39 | IC3.20 29.5,46.5 33.42,42.58 43.67,42.58 v43.75,42.5
  Bottom 0.152: v47.25,39 v43.75,42.5
GPIO2_B
  Top 0.152: IC8.20 66,46.5 66.5,46 66.5,38.75 64.13,36.38 TEENSY4.1.27
LED
  Top 0.305: TEENSY4.1.23 66.67,14.33 68.75,12.25 LED1.C
LRCK  (via drill 0.3)
  Top 0.152: IC3.16 25.85,44.5 v26.1,44.25 26.03,44.18 TEENSY4.1.42 | v50,42 46.75,42 46,41.25 32.41,41.25 29.5,44.16 v29.5,44.25 | IC8.16 64.75,44.5 v63.25,43
  Bottom 0.152: v26.1,44.25 v29.5,44.25 | v63.25,43 60.75,40.5 51.5,40.5 v50,42
N$1
  Top 0.254: C31.1 35,54.4 | IC3.27 31.1,50 35,53.9 35,54.4 | R27.2 35,54.4
N$2
  Top 0.254: 31.8,54.2 28.1,50.5 IC3.28 | 31.68,54.33 31.8,54.2 | R25.2 31.75,54.75 31.93,54.58 C28.1 31.85,54.25 31.8,54.2
N$3
  Top 0.254: R23.2 28.5,54.6 C26.1 28.6,53.6 26,51 IC3.29
N$4
  Top 0.254: IC3.30 25.35,51.95 C23.1 25.25,54.6 R21.2
N$5
  Top 0.254: IC3.1 19.1,53.25 C21.1 19.25,54.04 R16.2
N$6
  Top 0.254: IC3.2 18.25,51 16.75,52.5 15.4,52.5 C11.1 14.75,53.5 R12.2
N$7
  Top 0.254: IC3.3 17.75,50.5 16.25,52 10.5,52 9.15,53.35 C5.1 R7.2
N$8
  Top 0.254: IC3.4 17.25,50 16.5,50.75 4.75,50.75 C2.1 R2.2
N$9
  Top 0.254: C32.2 R27.1
N$10
  Top 0.254: C24.1 25.35,67.8 R20.1 25.35,74.3 IN1B.1
N$11
  Top 0.305: IC3.11 17.3,46.5 C15.1 16.8,44.55 C16.1
N$12
  Top 1.27: 16.3,8.9 C17.1 | C17.1 13.75,8.95 L1.2 | C17.1 19,8.95 | 19,8.95 19.95,8.95 CAN_UP.1 | D1.C 19,8.95
  Bottom 1.27: CAN_UP.1 25.9,3 40.1,3 CAN_DOWN.1
N$13
  Top 0.254: C27.1 28.6,67.8 R22.1 28.6,74.55 IN1B.2
N$14
  Top 0.254: R24.1 31.85,67.8 C30.1 | 31.75,70.1 R24.1 | IN1B.3 31.85,74.8 R24.1
N$15
  Top 0.254: C32.1 35,69.9 R26.1 35.1,74.75 IN1B.4
N$16
  Top 0.254: IN1A.4 16.6,73.55 R15.1 16.7,69.9 C12.1
N$17
  Top 0.254: R55.2 75,54.6 C63.1 75.1,53.75 71.35,50 IC8.27
N$18
  Top 0.254: IN1A.3 12.35,74.3 R9.1 12.45,69.9 C9.1
N$19
  Top 0.254: IN1A.2 8.1,74.75 R6.1 8.2,69.9 C4.1
N$20
  Top 0.254: C30.2 R25.1
N$21
  Top 0.254: IN1A.1 4.1,74.25 R4.1 3.95,69.85 C1.1
N$22
  Top 0.254: C27.2 R23.1
N$23
  Top 0.254: C4.2 6.3,65.65 R5.1
N$24
  Top 0.254: C9.2 10.55,65.6 R10.1
N$25
  Top 0.254: C1.2 2.05,65.6 R3.1
N$26
  Top 0.254: C12.2 14.8,65.65 R14.1
N$27
  Top 0.254: R53.2 71.75,54.6 C61.1 71.85,53.85 68.5,50.5 IC8.28
N$28
  Top 0.254: IC1.1 2.37,60.73 R1.2 0.97,60.57 0.97,58.36 1.61,57.72 1.63,57.72 C34.1
N$29
  Top 0.254: C35.1 10.25,57 10.75,57.5 10.75,59.35 R8.2 9.48,60.08 IC1.7
N$30
  Top 0.254: IC2.1 13.12,60.73 R11.2 11.5,60.35 11.5,58.75 12.5,57.75 C65.1
N$31
  Top 0.254: R1.1 2.18,60.08 IC1.2 4.58,60.08 4.75,60.25 4.75,64.6 R3.2
N$32
  Top 0.254: R8.1 8.97,59.43 IC1.6 7.07,59.43 6.75,59.75 6.75,62.75 7.85,63.85 R5.2
N$33
  Top 0.254: R11.1 12.93,60.08 IC2.2 15.33,60.08 15.5,60.25 15.5,62.35 R10.2
N$34
  Top 0.254: R17.1 19.97,59.43 IC2.6 17.82,59.43 17.5,59.75 17.5,64.35 R14.2
N$35
  Top 0.254: C66.1 21.75,56.95 21.75,59.35 R17.2 20.48,60.08 IC2.7
N$36
  Top 0.254: C24.2 R21.1
N$37
  Top 0.254: R13.1 14.55,50 15.93,50 16.93,49 C13.1
  Top 0.305: IC3.6 16.93,49
N$38
  Top 0.254: R51.2 68.5,54.6 C59.1 68.6,53.6 66,51 IC8.29
N$39
  Top 0.254: R49.2 65.25,54.6 C57.1 65.35,51.95 IC8.30
N$40
  Top 0.254: 59.34,53.76 C55.1 | C55.1 59.1,53 IC8.1 | R45.2 59.6,55.05 C55.1
N$41
  Top 0.254: C46.1 54.65,53.75 | IC8.2 58,51 56.53,52.47 54.78,52.47 54.4,52.85 C46.1 | R41.2 54.75,53.85 C46.1
N$42
  Top 0.254: R35.2 C41.1 48.9,53.35 50.25,52 56,52 57.5,50.5 IC8.3
N$43
  Top 0.305: IC8.11 57.05,46.5 C50.1 56.55,44.55 C51.1
N$44
  Top 0.254: IN2B.1 65.35,74.3 R48.1 65.35,67.8 C58.1
N$45
  Top 0.254: IN2B.2 68.6,74.55 R50.1 68.6,67.8 C60.1
N$46
  Top 0.254: IN2B.3 71.85,74.8 R52.1 71.85,67.8 C62.1
N$47
  Top 0.254: IN2B.4 75.1,74.75 R54.1 75.1,67.8 C64.1
N$48
  Top 0.254: R29.1 42.18,60.08 IC6.2 44.58,60.08 44.75,60.25 44.75,64.85 R31.2
N$49
  Top 0.254: R36.1 48.97,59.43 IC6.6 47.07,59.43 46.75,59.75 46.75,63 47.85,64.1 47.85,65.25 R33.2
N$50
  Top 0.254: R39.1 52.93,60.08 IC7.2 55.08,60.08 55.5,60.5 55.5,62.6 R38.2
N$51
  Top 0.254: R46.1 59.97,59.43 58.75,59.43 IC7.6 58.07,59.43 57.75,59.75 57.75,59.8 57.73,59.81 57.73,64.61 R44.2
N$52
  Top 0.254: C40.2 46.3,67.5 46.3,65.6 R33.1
N$53
  Top 0.254: C44.2 50.8,65.6 R38.1
N$54
  Top 0.254: C47.2 55.05,65.6 R44.1
N$55
  Top 0.254: C37.2 42.3,65.6 R31.1
N$56
  Top 0.254: IN2A.4 56.6,73.55 R43.1 56.6,68.1 C47.1
N$57
  Top 0.254: IN2A.3 52.35,74.3 R37.1 52.35,68.1 C44.1
N$58
  Top 0.254: C40.1 48.35,67.85 R34.1 48.35,74.8 IN2A.2
N$59
  Top 0.254: IN2A.1 44.35,74.5 R32.1 44.35,67.9 C37.1
N$60
  Top 0.254: IC8.4 57,50 56.25,50.75 45.15,50.75 C38.1 R30.2
N$61
  Top 0.254: C62.2 R53.1
N$62
  Top 0.254: C60.2 R51.1
N$63
  Top 0.254: C58.2 R49.1
N$64
  Top 0.254: C64.2 R55.1
N$65
  Top 0.254: C48.1 56.07,49.78 53.78,49.78 53.3,49.3 R40.1
  Top 0.305: IC8.6 C48.1
N$66
  Top 0.254: IC7.1 53.12,60.73 R39.2 51.5,60.35 51.5,58.5 52.5,57.5 C69.1
N$67
  Top 0.254: C68.1 50.75,57.2 50.75,59.35 R36.2 49.48,60.08 IC6.7
N$68
  Top 0.254: IC6.1 42.37,60.73 R29.2 40.75,60.35 40.75,58.7 C67.1
N$69
  Top 0.254: C70.1 61.5,57.5 61.75,57.75 61.75,59.35 R46.2 60.48,60.08 IC7.7
N$70  (via drill 0.35)
  Top 0.254: IC6.3 45.57,59.43 46.1,58.9 46.1,58.75 | IC7.3 56.32,59.43 57,58.75 | 57,58.75 58.59,58.75 IC7.5 | 57,58.75 C52.2 56.85,57.1 55.75,56 v55.75,55 | R40.2 v51.25,49 50.1,49 C43.1 47.5,49.1 47.25,49.35 v47.25,49.5 | v46.25,54 46.1,54.15 C39.2 46.1,58.75 | IC6.5 47.84,58.75 46.1,58.75
  Bottom 0.254: v46.25,54 47.25,53 v47.25,49.5 | v55.75,55 51.25,50.5 v51.25,49
N$71
  Top 0.305: LED1.A R56.1
N$73
  Top 0.254: C34.2 2.4,52.95 R2.1
N$74  (via drill 0.35)
  Top 0.254: R13.2 v11.5,49 10.35,49 C8.1 10,48.85 7.4,48.85 v6.75,49.5 | v6.25,53.75 6.1,53.9 C3.2 6.1,58.9 | v18.25,55.25 18.25,56.6 17.75,57.1 C18.2 17,58.17 17.02,58.27 17.5,58.75 | IC1.3 5.57,59.43 6.1,58.9 | IC1.5 7.84,58.75 6.25,58.75 6.1,58.9 | IC2.3 16.32,59.43 17,58.75 17.5,58.75 | 17.5,58.75 18.59,58.75 IC2.5
  Bottom 0.254: v6.75,49.5 6.25,50 v6.25,53.75 | v11.5,49 11.75,49 v18.25,55.25
N$75
  Top 0.254: C35.2 8.7,56.35 8.25,56.35 R7.1
N$76
  Top 0.254: 14.75,57.05 R12.1 14.13,57.1 13.53,56.5 13.53,55.83 C65.2
N$77
  Top 0.254: R16.1 19.25,57.05 C66.2
N$78
  Top 0.254: R45.1 59.25,57.05 C70.2
N$79
  Top 0.254: 54.75,57.05 R41.1 54.1,57.1 53.53,56.53 53.53,55.83 C69.2
N$80
  Top 0.152: TEENSY4.1.11 36.19,24.19 37.5,25.5 37.5,33.75 39.54,35.79 JP1.1
N$81
  Top 0.254: 48,56.55 R35.1 48.5,56.6 48.5,56.5 50.2,54.8 C68.2
N$82
  Top 0.254: C67.2 R30.1
SCL  (via drill 0.3)
  Top 0.152: v22.25,36.75 22.25,39.75 22.65,40.15 R19.1 22.5,41.5 22,42 22,47.18 23.32,48.5 IC3.24 26.5,48.5 27.25,47.75 31,47.75 34,44.75 v51.25,44.75 | IC8.24 63.7,48.5 v61.3,46.1
  Bottom 0.152: TEENSY4.1.41 23.44,36.75 v22.25,36.75 | v61.3,46.1 59.95,44.75 v51.25,44.75
SDA  (via drill 0.3)
  Top 0.152: v23.25,37.5 23.25,42.15 R18.1 22.65,47.05 23.6,48 IC3.23 26.25,48 26.95,47.3 30.45,47.3 33.75,44 v52,44 | IC8.23 64.1,48 v62.2,46.1
  Bottom 0.152: TEENSY4.1.40 25.23,37.5 v23.25,37.5 | v62.2,46.1 60.1,44 v52,44
VDD
  Top 0.152: IC8.13 59.9,45.5 63.4,49 IC8.25
  Top 0.254: C20.1 20.85,41 R19.2 R18.2
  Top 0.305: IC3.13 IC3.14 20,45 20.25,44.75 20.25,43.75 19.55,43.05 C19.1 19.55,41.3 C20.1 | IC4.3 26.43,11.18 26.8,11.55 C25.1 28.75,14 C29.1 30.15,13.72 30.87,13 42.97,13 TEENSY4.1.15 | IC8.13 IC8.14 60,45 60.25,44.75 60.25,43.2 C53.1 60.05,41.5 60.3,41.25 C54.1 | TEENSY4.1.55 61.04,21.46 65.4,17.1 65.4,13.4 64.35,12.35 R56.2 R47.2
  Top 0.508: C20.1 19.85,36.85 15.87,32.87 TEENSY4.1.46 21,26.49 21,18.75 22,17.75 24,17.75 24.75,17 24.75,15.75 25.25,15.25 27.5,15.25 28.75,14 | C54.1 60.35,36.35 57.75,33.75 57.75,22.7 TEENSY4.1.55
  Bottom 0.508: TEENSY4.1.15 51.43,21.46 TEENSY4.1.55
VDDA  (via drill 0.35)
  Top 0.254: IC1.8 8.48,60.73 9.65,61.9 C7.1 | IC2.8 19.23,60.73 20.4,61.9 C22.1 | IC6.8 48.58,60.73 49.75,61.9 C42.1 | IC7.8 59.58,60.73 C56.1
  Top 0.305: C10.1 14.15,48 16.33,48 16.8,47.53 C14.1 16.8,47.5 17.3,48 IC3.8 20.5,48 v21.25,48.75 | IC8.8 57.05,48 56.55,47.5 C49.1 56.55,47.45 56,48 54.15,48 C45.1 53.1,47.1 52.25,46.25 43.75,46.25 v43,47 | C36.1 34.75,51 33,49.25 v27.25,49.25 | 38.3,49.2 IC5.5
  Top 0.406: IC5.5 38.3,50.9 C36.1
  Top 0.508: C36.1 38,51.4 v38,52 v38,62 | v48,62 49.9,62 C42.1 50.68,61.9 51.28,62.5 v53.5,62.5 | v58.75,62.5 60.15,62.5 C56.1 | v23,62 22.9,61.9 C22.1 19.1,61.9 v18.75,62.25 | v12.75,62.75 11.35,62.75 10.5,61.9 C7.1
  Bottom 0.305: v21.25,48.75 21.75,49.25 v27.25,49.25 | v43,47 v38,52
  Bottom 0.508: v48,62 v38,62 v23,62 | v53.5,62.5 v58.75,62.5 | v18.75,62.25 18.25,62.75 v12.75,62.75

### Text on the board
tNames: 5V / GND / CAN Lo / CAN Hi / IO